# Altium project FIT_PM12.PrjPcb (part 3 of 13)

## Sheet PM12_LDO.SchDoc: FIT_PM12 board
size 420 x 297 mm; CheckedBy: G.Kasprowicz; Author: INR Moscow; CompanyName: WUT ISE; DrawnBy: M.Podgórski; Organization: WUT ISE; Address1: PW ISE; Address2: Nowowiejska 15/19 00-665 Warsaw; Address3: gkasprow@gmail.com; DocumentNumber: 12; Revision: 2; SheetNumber: 14; SheetTotal: 34; ModifiedBy: -; CheckedDate: -; Title2: LDOs; DivGrp: WUT ISE; Designer: INR RAS; ModifiedDate: -; ProjectName: Sensor Box
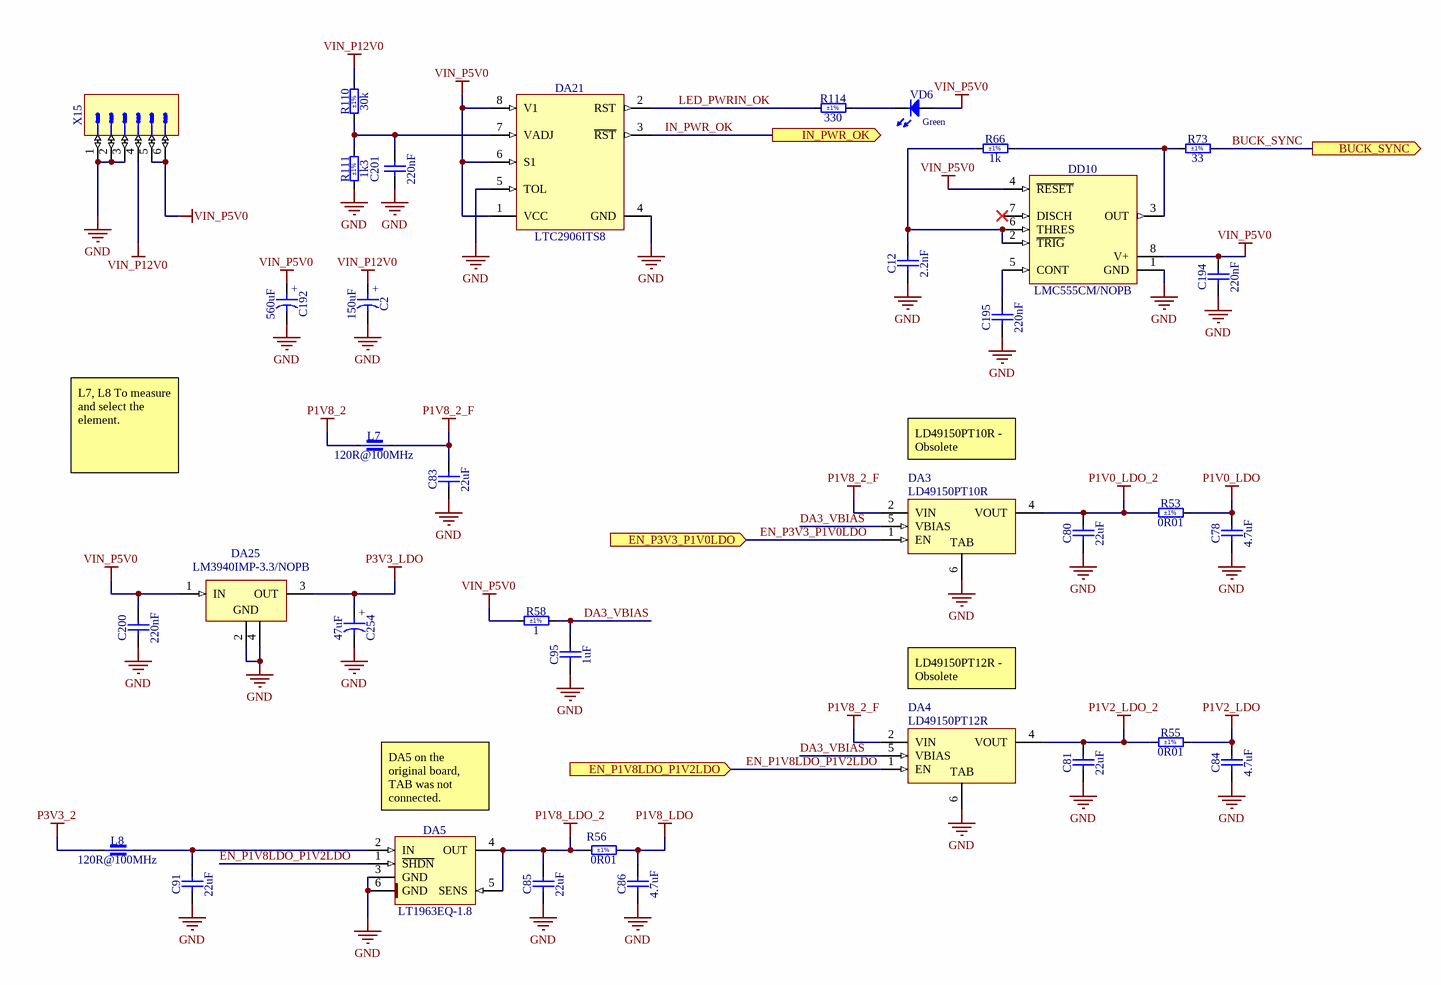
[diagram p6: PM12_LDO.SchDoc]

### Parts
C2  150uF  [CAPAE830X1020N]
C12  2.2nF  [CAPC2013X100N]
C78  4.7uF  [CAPC2012X145N]
C80  22uF  [CAPC3216X180N]
C81  22uF  [CAPC3216X180N]
C83  22uF  [CAPC3216X180N]
C84  4.7uF  [CAPC2012X145N]
C85  22uF  [CAPC3216X180N]
C86  4.7uF  [CAPC2012X145N]
C91  22uF  [CAPC3216X180N]
C95  1uF  [CAPC2012X140N]
C192  560uF  [CAPAE830X1020N]
C194  220nF  [CAPC2012X135N]
C195  220nF  [CAPC2012X135N]
C200  220nF  [CAPC2012X135N]
C201  220nF  [CAPC2012X135N]
C254  47uF  [CAPAE530X610N]
DA3  LD49150PT10R  [PPAK_N]
DA4  LD49150PT12R  [PPAK_M]
DA5  LT1963EQ-1.8  [TO170P1394X457-6N-R900X1060]
DA21  LTC2906ITS8  [SOT65P280X100-8N]
DA25  LM3940IMP-3.3/NOPB  [SOT230P700X180-4N]
DD10  LMC555CM/NOPB  [SOIC127P600X175-8N]
L7  120R@100MHz  [IND_MURATA_BLM31KN]
L8  120R@100MHz  [IND_MURATA_BLM31KN]
R53  0R01  Tolerance: ±1%  [RESC3216X80N]
R55  0R01  Tolerance: ±1%  [RESC3216X80N]
R56  0R01  Tolerance: ±1%  [RESC3216X80N]
R58  1  Tolerance: ±1%  [RESC2012X60N]
R66  1k  Tolerance: ±1%  [RESC2012X60N]
R73  33  Tolerance: ±1%  [RESC2012X60N]
R110  30k  Tolerance: ±1%  [RESC2012X60N]
R111  1k3  Tolerance: ±1%  [RESC2012X60N]
R114  330  Tolerance: ±1%  [RESC2012X60N]
VD6  Green  [LED_KINGBRIGHT_KP-2012LSGC]
X15  Mini-Fit BMI  [MOLEX_15-24-9067]  (value not drawn)

### Ports
BUCK_SYNC (out), EN_P1V8LDO_P1V2LDO (in), EN_P3V3_P1V0LDO (in), IN_PWR_OK (out)

### Nets
GND: C2.2 C12.1 C78.1 C80.1 C81.1 C83.1 C84.1 C85.1 C86.1 C91.1 C95.1 C192.2 C194.1 C195.1 C200.1 C201.1 C254.2 DA3.6(TAB) DA4.6(TAB) DA5.3(GND) DA5.6(GND) DA21.4(GND) DA21.5(TOL) DA25.2(GND) DA25.4(GND) DD10.1(GND) R111.1 X15.1 X15.2 X15.3
P1V0_LDO: C78.2 R53.2
P1V0_LDO_2: C80.2 DA3.4(VOUT) R53.1
P1V2_LDO: C84.2 R55.2
P1V2_LDO_2: C81.2 DA4.4(VOUT) R55.1
P1V8_2: L7.1
P1V8_2_F: C83.2 DA3.2(VIN) DA4.2(VIN) L7.2
P1V8_LDO: C86.2 R56.2
P1V8_LDO_2: C85.2 DA5.4(OUT) DA5.5(SENS) R56.1
P3V3_2: L8.1
P3V3_LDO: C254.1 DA25.3(OUT)
VIN_P5V0: C192.1 C194.2 C200.2 DA21.1(VCC) DA21.6(S1) DA21.8(V1) DA25.1(IN) DD10.4(~{RESET}) DD10.8(V+) R58.1 VD6.2(A) X15.5 X15.6  [project net P3V3]
VIN_P12V0: C2.1 R110.2 X15.4
BUCK_SYNC: R73.2 ; port BUCK_SYNC
DA3_VBIAS: C95.2 DA3.5(VBIAS) DA4.5(VBIAS) R58.2
EN_P1V8LDO_P1V2LDO: DA4.1(EN) DA5.1(~{SHDN}) ; port EN_P1V8LDO_P1V2LDO
EN_P3V3_P1V0LDO: DA3.1(EN) ; port EN_P3V3_P1V0LDO
IN_PWR_OK: DA21.3(~{RST}) ; port IN_PWR_OK
LED_PWRIN_OK: DA21.2(RST) R114.1
NetC12_2: C12.2 DD10.2(~{TRIG}) DD10.6(THRES) R66.1
NetC91_2: C91.2 DA5.2(IN) L8.2
NetC195_2: C195.2 DD10.5(CONT)
NetC201_2: C201.2 DA21.7(VADJ) R110.1 R111.2
NetDD10_3: DD10.3(OUT) R66.2 R73.1
NetR114_2: R114.2 VD6.1(C)

Not connected (* = marked no-connect by the designer): DD10 7(DISCH)*

### Notes on the sheet
- L7, L8 To measure and select the element.
- LD49150PT10R - Obsolete
- LD49150PT12R - Obsolete
- (near DA5) DA5 on the original board, TAB was not connected.
- Project/Equipment
- Document
- Designer
- Drawn by
- Check.by
- Copyright WUT ISE 2024.
  This documentation describes Open Hardware and is licensed under the CERN OHL v.2. You may redistribute and modify this documentation under the terms of the CERN OHL v.2. (http://ohwr.org/CERNOHL). This documentation is distributed WITHOUT ANY EXPRESS OR IMPLIED WARRANTY, INCLUDING OF MERCHANTABILITY, SATISFACTORY QUALITY AND FITNESS FOR A PARTICULAR PURPOSE. Please see the CERN OHL v.2 for applicable conditions.
- Contact
- File
- Last Mod.
- Print Date
- Sheet
- Size
- A3
- of
- Rev
- (in symbol CAE530-610_47UF_16V_20%) +
- (in symbol CAE830-1020_150UF_25V_20%) +
- (in symbol CAE830-1020_560UF_10V_20%) +

### Library data of the parts
C2 = CAE830-1020_150UF_25V_20%: Polarised capacitor; Part Description: Aluminum Electrolytic SMT Capacitor; Manufacturer: PANASONIC; Manufacturer Part Number: EEEFP1E151AP; Voltage: 25V; Tolerance: ±20%; Part Number: CAE830-1020_150UF_25V_20%; Component Kind: Standard; Component Type: Standard; Pin Count: 2; Value: 150uF; Status: Not Recommended; Case: F; Mounted: Yes; Socket: No; SMD: Yes; Sense: No; ComponentHeight: 10.2mm; HelpURL: \\cern.ch\dfs\Applications\Altium\Datasheets\CAE_PANASONIC_FP.pdf; Author: CERN DEM HF; CreateDate: 24.05.2024; LatestRevisionDate: 24.05.2024
C12 = CC0805_2.2NF_50V_5%_C0G: Non-polarised capacitor; Part Description: SMD Multilayer Chip Ceramic Capacitor; Manufacturer: GENERIC; Manufacturer1 Part Number: C0805C222J5GACTU; Voltage: 50V; TC: C0G/NP0; Tolerance: ±5%; Part Number: CC0805_2.2NF_50V_5%_C0G; Component Kind: Standard; Component Type: Standard; Pin Count: 2; Value: 2.2nF; Status: None; Manufacturer Part Number: CC0805_2.2NF_50V_5%_C0G; Case: 0805; Mounted: Yes; Socket: No; SMD: Yes; Sense: No; Manufacturer1 Example: KEMET; Manufacturer1 ComponentHeight: 0.88mm; HelpURL: \\cern.ch\dfs\Applications\Altium\Datasheets\CC0805_C0G_KEMET_(Commercial Grade).pdf; Author: CERN DEM MR; CreateDate: 26.01.2016; LatestRevisionDate: 26.01.2016
C78 C84 C86 = CC0805_4.7UF_50V_10%_X7R: Non-polarised capacitor; Part Description: SMD Multilayer Chip Ceramic Capacitor; Manufacturer: GENERIC; Manufacturer1 Part Number: C2012X7R1H475K125; Voltage: 50V; TC: X7R; Tolerance: ±10%; Part Number: CC0805_4.7UF_50V_10%_X7R; Component Kind: Standard; Component Type: Standard; Pin Count: 2; Value: 4.7uF; Status: Preferred; Manufacturer Part Number: CC0805_4.7UF_50V_10%_X7R; Case: 0805; Mounted: Yes; Socket: No; SMD: Yes; Sense: No; Manufacturer1 Example: TDK; Manufacturer1 ComponentHeight: 1.45mm; HelpURL: \\cern.ch\dfs\Applications\Altium\Datasheets\CC0805_X7R_TDK_C.pdf; Author: CERN DEM JMW; CreateDate: 30.07.2021; LatestRevisionDate: 30.07.2021
C80 C81 C83 C85 C91 = CC1206_22UF_25V_20%_X5R: Non-polarised capacitor; Part Description: SMD Multilayer Chip Ceramic Capacitor; Manufacturer: GENERIC; Manufacturer1 Part Number: C3216X5R1E226M160; Voltage: 25V; TC: X5R; Tolerance: ±20%; Part Number: CC1206_22UF_25V_20%_X5R; Component Kind: Standard; Component Type: Standard; Pin Count: 2; Value: 22uF; Status: None; Manufacturer Part Number: CC1206_22UF_25V_20%_X5R; Case: 1206; Mounted: Yes; Socket: No; SMD: Yes; Sense: No; Manufacturer1 Example: TDK; Manufacturer1 ComponentHeight: 1.8mm; HelpURL: \\cern.ch\dfs\Applications\Altium\Datasheets\CC1206_X5R_TDK_C.pdf; Author: CERN DEM WB; CreateDate: 25.07.2018; LatestRevisionDate: 25.07.2018
C95 = CC0805_1UF_25V_10%_X7R: Non-polarised capacitor; Part Description: SMD Multilayer Chip Ceramic Capacitor; Manufacturer: GENERIC; Manufacturer1 Part Number: C0805C105K3RAC; Voltage: 25V; TC: X7R; Tolerance: ±10%; Part Number: CC0805_1UF_25V_10%_X7R; Component Kind: Standard; Component Type: Standard; Pin Count: 2; Value: 1uF; Status: Preferred; Manufacturer Part Number: CC0805_1UF_25V_10%_X7R; Case: 0805; Mounted: Yes; Socket: No; SMD: Yes; Sense: No; Manufacturer1 Example: KEMET; Manufacturer1 ComponentHeight: 1.4mm; HelpURL: \\cern.ch\dfs\Applications\Altium\Datasheets\CC0805_X7R_KEMET.pdf; Author: CERN DEM JLC; CreateDate: 23.03.2009; LatestRevisionDate: 23.03.2009
C192 = CAE830-1020_560UF_10V_20%: Polarised capacitor; Part Description: Aluminum Electrolytic SMT Capacitor; Manufacturer: PANASONIC; Manufacturer Part Number: EEEFH1A561L; Voltage: 10V; Tolerance: ±20%; Part Number: CAE830-1020_560UF_10V_20%; Component Kind: Standard; Component Type: Standard; Pin Count: 2; Value: 560uF; Status: Not Recommended; Case: F; Mounted: Yes; Socket: No; SMD: Yes; Sense: No; ComponentHeight: 10.2mm; HelpURL: \\cern.ch\dfs\Applications\Altium\Datasheets\CAE_PANASONIC_FH.pdf; Author: CERN DEM HF; CreateDate: 24.05.2024; LatestRevisionDate: 24.05.2024
C194 C195 C200 C201 = CC0805_220NF_50V_10%_X7R: Non-polarised capacitor; Part Description: SMD Multilayer Chip Ceramic Capacitor; Manufacturer: GENERIC; Manufacturer1 Part Number: GRM21BR71H224KA01L; Voltage: 50V; TC: X7R; Tolerance: ±10%; Part Number: CC0805_220NF_50V_10%_X7R; Component Kind: Standard; Component Type: Standard; Pin Count: 2; Value: 220nF; Status: Preferred; Manufacturer Part Number: CC0805_220NF_50V_10%_X7R; Case: 0805; Mounted: Yes; Socket: No; SMD: Yes; Sense: No; Manufacturer1 Example: MURATA; Manufacturer1 ComponentHeight: 1.35mm; HelpURL: \\cern.ch\dfs\Applications\Altium\Datasheets\CC0805_X7R_MURATA.pdf; Author: CERN DEM JLC; CreateDate: 03.12.2007; LatestRevisionDate: 03.12.2007
C254 = CAE530-610_47UF_16V_20%: Polarised capacitor; Part Description: Conductive Polymer Hybrid Aluminum Electrolytic Capacitor; Manufacturer: CHEMI-CON; Manufacturer Part Number: HHXD160ARA470ME61G; Voltage: 16V; Tolerance: ±20%; Part Number: CAE530-610_47UF_16V_20%; Component Kind: Standard; Component Type: Standard; Pin Count: 2; Value: 47uF; Status: Not Recommended; Case: C; Mounted: Yes; Socket: No; SMD: Yes; Sense: No; ComponentHeight: 6.1mm; HelpURL: \\cern.ch\dfs\Applications\Altium\Datasheets\CAE_CHIMI-CON_HXD.pdf; Author: CERN DEM HF; CreateDate: 15.04.2024; LatestRevisionDate: 15.04.2024
DA3 = CMP-0244-00092-1: 1.5 Very Low Drop Voltage Regulator, 1.0V, 5-Pin PPAK, Tape and Reel; ComponentLink1URL: http://www.st.com; ComponentLink2Description: Datasheet; PackageVersion: 1/06/2004; DatasheetVersion: 1/06/2010; PackageDescription: 5-Pin Transistor Outline Package 1.27 mm Pitch, 9.7 mm Lead Span; ComponentLink1Description: Manufacturer URL; ComponentLink2URL: http://www.st.com/internet/com/TECHNICAL_RESOURCES/TECHNICAL_LITERATURE/DATASHEET/CD00157522.pdf; PackageReference: PPAK
DA4 = CMP-0244-00093-1: 1.5 Very Low Drop Voltage Regulator, 1.2V, 5-Pin PPAK, Tape and Reel; ComponentLink2URL: http://www.st.com/internet/com/TECHNICAL_RESOURCES/TECHNICAL_LITERATURE/DATASHEET/CD00157522.pdf; DatasheetVersion: 1/06/2010; ComponentLink1Description: Manufacturer URL; ComponentLink2Description: Datasheet; ComponentLink1URL: http://www.st.com; PackageDescription: 5-Pin Transistor Outline Package 1.27 mm Pitch, 9.7 mm Lead Span; PackageReference: PPAK; PackageVersion: 1/06/2004
DA5 = LT1963EQ-1.8: 1.5A, Fast Transient Response LDO Regulators; Part Description: 1.5A, 1.8V, Fast Transient Response, LDO Regulator; Manufacturer: ANALOG DEVICES; PressFit: No; Bonding: No; Part Number: LT1963EQ-1.8; Component Kind: Standard; Component Type: Standard; Device: LT1963EQ-1.8; PackageDescription: D2PAK TO-263, TO, 1.70mm Pitch; 5 Pin, 13.945mm L X 8.89mm W X 4.572mm H body, IPC Medium Density; Manufacturer Part Number: LT1963EQ-1.8; Pin Count: 6; Case: TO-263-5; Mounted: Yes; Socket: No; SMD: Yes; Sense: No; ComponentHeight: 4.57mm; HelpURL: \\cern.ch\dfs\Applications\Altium\Datasheets\LT1963.pdf; Author: CERN DEM HF; CreateDate: 05.06.2024; LatestRevisionDate: 05.06.2024
DA21 = LTC2906ITS8: Precision Dual Supply Monitors with One Pin-Selectable Threshold and One Adjustable Input; Manufacturer: LINEAR TECHNOLOGY; PressFit: No; Bonding: No; Part Number: LTC2906ITS8; Component Kind: Standard; Component Type: Standard; Device: LTC2906ITS8; PackageDescription: SOT, 0.65mm Pitch; 8 Pin, 1.625mm W X 2.90mm L X 1.00mm H Body, IPC Medium Density; Part Description: Precision Dual Supply Monitors with One Pin-Selectable Threshold and One Adjustable Input; Manufacturer Part Number: LTC2906ITS8; Pin Count: 8; Case: SOT23-8; Mounted: Yes; Socket: No; SMD: Yes; Sense: No; ComponentHeight: 1mm; Author: CERN DEM HF; HelpURL: \\cern.ch\dfs\Applications\Altium\Datasheets\LTC2906.pdf; CreateDate: 05.06.2024; LatestRevisionDate: 05.06.2024
DA25 = LM3940IMP-3.3/NOPB: 3-Terminal Regulator 1=IN 2=GND 3=OUT 4=GND; Part Description: 1A Low Dropout Regulator for 5V to 3.3V Conversion; Manufacturer: TEXAS INSTRUMENTS; PressFit: No; Bonding: No; Part Number: LM3940IMP-3.3/NOPB; Component Kind: Standard; Component Type: Standard; Device: LM3940IMP-3.3/NOPB; PackageDescription: SOT223, 2.30mm Pitch; 4 Pin, 3.70mm W X 6.70mm L X 1.80mm H body, IPC Medium Density; Manufacturer Part Number: LM3940IMP-3.3; Pin Count: 4; Case: SOT223; Mounted: Yes; Socket: No; SMD: Yes; Sense: No; ComponentHeight: 1.8mm; HelpURL: \\cern.ch\dfs\Applications\Altium\Datasheets\LM3940IMP-3.3-NOPB.pdf; Author: CERN DEM JLC; CreateDate: 28.03.2011; LatestRevisionDate: 01.06.2022
DD10 = LMC555CM/NOPB: CMOS Timer; Manufacturer: NATIONAL SEMICONDUCTOR; PressFit: No; Bonding: No; Part Number: LMC555CM/NOPB; Component Kind: Standard; Component Type: Standard; Device: LMC555CM/NOPB; PackageDescription: SOIC 8, Pitch 1.27mm, Body 4x5mm, IPC Medium Density; Part Description: CMOS Timer; Manufacturer Part Number: LMC555CM; Pin Count: 8; Case: SOIC8; Mounted: Yes; Socket: No; SMD: Yes; Sense: No; ComponentHeight: 1.75mm; Author: CERN DEM JLC; HelpURL: \\cern.ch\dfs\Applications\Altium\Datasheets\LMC555C-NOPB.pdf; CreateDate: 12.04.2010; LatestRevisionDate: 01.06.2022
L7 L8 = IND1206_MURATA_BLM31KN121SN1: Part Description: SMD Chip Ferrite Bead, BLM31KN_SN Series; Manufacturer: MURATA; Power: 6A; Resistance: 0.009R; Tolerance: ±25%; Part Number: IND1206_MURATA_BLM31KN121SN1; Component Kind: Standard; Component Type: Standard; Footprint: IND_MURATA_BLM31KN1; Pin Count: 2; Value: 120R@100MHz; Manufacturer Part Number: BLM31KN121SN1; Case: 1206; Mounted: Yes; Socket: No; SMD: Yes; Sense: No; ComponentHeight: 1.8mm; HelpURL: \\cern.ch\dfs\Applications\Altium\Datasheets\IND1206_MURATA_ BLM31KN_SN.pdf; Author: CERN DEM HF; CreateDate: 05.01.2022; LatestRevisionDate: 05.01.2022
R53 R55 R56 = R1206_0R01_1%_1W_100PPM_TT_LRMAM1206: Resistor - 1%; Part Description: Low Value Metal Alloy Resistor; Manufacturer: TT Electronics; Manufacturer Part Number: LRMAM1206-R01FT5; Power: 1W; TC: ±100ppm/°C; PressFit: No; Part Number: R1206_0R01_1%_1W_100PPM_TT_LRMAM1206; Component Kind: Standard; Component Type: Standard; Pin Count: 2; Value: 0R01; Status: Not Recommended; Case: 1206; Mounted: Yes; Sense: No; Socket: No; SMD: Yes; ComponentHeight: 0.8mm; HelpURL: \\cern.ch\dfs\Applications\Altium\Datasheets\R1206_TT ELECTRONICS_LRMA.pdf; Author: CERN DEM BC; CreateDate: 29.07.2015; LatestRevisionDate: 29.07.2015
R58 = R0805_1R_1%_0.125W_100PPM: Resistor - 1%; Part Description: Thick Film Chip Resistor; Manufacturer: GENERIC; Manufacturer1 Part Number: CRCW08051R00FKEA; Power: 0.125W; TC: ±100ppm/°C; PressFit: No; Part Number: R0805_1R_1%_0.125W_100PPM; Component Kind: Standard; Component Type: Standard; Pin Count: 2; Value: 1; Status: None; Manufacturer Part Number: R0805_1R_1%_0.125W_100PPM; Case: 0805; Mounted: Yes; Sense: No; Socket: No; SMD: Yes; Manufacturer1 Example: VISHAY; Manufacturer1 ComponentHeight: 0.6mm; HelpURL: \\cern.ch\dfs\Applications\Altium\Datasheets\R0805_VISHAY_CRCW e3.pdf; Author: CERN DEM HF; CreateDate: 07.06.2024; LatestRevisionDate: 07.06.2024
R66 = R0805_1K_1%_0.125W_100PPM: Resistor - 1%; Part Description: General Purpose Thick Film Chip Resistor; Manufacturer: GENERIC; Manufacturer1 Part Number: NRC10F1001TRF; Power: 0.125W; TC: ±100ppm/°C; PressFit: No; Part Number: R0805_1K_1%_0.125W_100PPM; Component Kind: Standard; Component Type: Standard; Pin Count: 2; Value: 1k; Status: Preferred; Manufacturer Part Number: R0805_1K_1%_0.125W_100PPM; Case: 0805; Mounted: Yes; Sense: No; Socket: No; SMD: Yes; Manufacturer1 Example: NIC COMPONENT; Manufacturer1 ComponentHeight: 0.6mm; HelpURL: \\cern.ch\dfs\Applications\Altium\Datasheets\R0805_NIC_NRC.pdf; Author: CERN DEM JLC; CreateDate: 03.12.2007; LatestRevisionDate: 13.03.2008
R73 = R0805_33R_1%_0.125W_100PPM: Resistor - 1%; Part Description: General Purpose Thick Film Chip Resistor; Manufacturer: GENERIC; Manufacturer1 Part Number: NRC10F33R0TRF; Power: 0.125W; TC: ±100ppm/°C; PressFit: No; Part Number: R0805_33R_1%_0.125W_100PPM; Component Kind: Standard; Component Type: Standard; Pin Count: 2; Value: 33; Status: Preferred; Manufacturer Part Number: R0805_33R_1%_0.125W_100PPM; Case: 0805; Mounted: Yes; Sense: No; Socket: No; SMD: Yes; Manufacturer1 Example: NIC COMPONENT; Manufacturer1 ComponentHeight: 0.6mm; HelpURL: \\cern.ch\dfs\Applications\Altium\Datasheets\R0805_NIC_NRC.pdf; Author: CERN DEM JLC; CreateDate: 03.12.2007; LatestRevisionDate: 13.03.2008
R110 = R0805_30K_1%_0.125W_100PPM: Resistor - 1%; Part Description: General Purpose Thick Film Chip Resistor; Manufacturer: GENERIC; Manufacturer1 Part Number: NRC10F3002TRF; Power: 0.125W; TC: ±100ppm/°C; PressFit: No; Part Number: R0805_30K_1%_0.125W_100PPM; Component Kind: Standard; Component Type: Standard; Pin Count: 2; Value: 30k; Status: Preferred; Manufacturer Part Number: R0805_30K_1%_0.125W_100PPM; Case: 0805; Mounted: Yes; Sense: No; Socket: No; SMD: Yes; Manufacturer1 Example: NIC COMPONENT; Manufacturer1 ComponentHeight: 0.6mm; HelpURL: \\cern.ch\dfs\Applications\Altium\Datasheets\R0805_NIC_NRC.pdf; Author: CERN DEM JLC; CreateDate: 03.12.2007; LatestRevisionDate: 13.03.2008
R111 = R0805_1K3_1%_0.125W_100PPM: Resistor - 1%; Part Description: General Purpose Thick Film Chip Resistor; Manufacturer: GENERIC; Manufacturer1 Part Number: NRC10F1301TRF; Power: 0.125W; TC: ±100ppm/°C; PressFit: No; Part Number: R0805_1K3_1%_0.125W_100PPM; Component Kind: Standard; Component Type: Standard; Pin Count: 2; Value: 1k3; Status: Preferred; Manufacturer Part Number: R0805_1K3_1%_0.125W_100PPM; Case: 0805; Mounted: Yes; Sense: No; Socket: No; SMD: Yes; Manufacturer1 Example: NIC COMPONENT; Manufacturer1 ComponentHeight: 0.6mm; HelpURL: \\cern.ch\dfs\Applications\Altium\Datasheets\R0805_NIC_NRC.pdf; Author: CERN DEM JLC; CreateDate: 03.12.2007; LatestRevisionDate: 13.03.2008
R114 = R0805_330R_1%_0.125W_100PPM: Resistor - 1%; Part Description: General Purpose Thick Film Chip Resistor; Manufacturer: GENERIC; Manufacturer1 Part Number: NRC10F3300TRF; Power: 0.125W; TC: ±100ppm/°C; PressFit: No; Part Number: R0805_330R_1%_0.125W_100PPM; Component Kind: Standard; Component Type: Standard; Pin Count: 2; Value: 330; Status: Preferred; Manufacturer Part Number: R0805_330R_1%_0.125W_100PPM; Case: 0805; Mounted: Yes; Sense: No; Socket: No; SMD: Yes; Manufacturer1 Example: NIC COMPONENT; Manufacturer1 ComponentHeight: 0.6mm; HelpURL: \\cern.ch\dfs\Applications\Altium\Datasheets\R0805_NIC_NRC.pdf; Author: CERN DEM JLC; CreateDate: 03.12.2007; LatestRevisionDate: 13.03.2008
VD6 = LED_KINGBRIGHT_KP-2012LSGC: LED Green 1C 2A; Part Description: 2.0x1.2mm Surface Mount Green LED; PressFit: No; Bonding: No; Part Number: LED_KINGBRIGHT_KP-2012LSGC; Component Kind: Standard; Component Type: Standard; Color: Green; PackageDescription: 2.0x1.2mm Surface Mount Green LED; Manufacturer: KINGBRIGHT; Manufacturer Part Number: KP-2012LSGC; Pin Count: 2; Case: 0805; Mounted: Yes; Socket: No; SMD: Yes; Sense: No; ComponentHeight: 1.1mm; HelpURL: \\cern.ch\dfs\Applications\Altium\Datasheets\LED_KINGBRIGHT_KP-2012LSGC.pdf; Author: CERN DEM BC; CreateDate: 09.11.2020; LatestRevisionDate: 09.11.2020
X15 = MOLEX_15-24-9067: Connector 6 Male; Part Description: Mini-Fit BMI Header, Dual Row, Right-Angle, with Snap-in Plastic Peg PCB Lock, 6 Circuits, Gold (Au) Plating; Manufacturer: MOLEX; PressFit: No; Part Number: MOLEX_15-24-9067; Component Kind: Standard; Component Type: Standard; Pin Count: 6; Family: Mini-Fit BMI; Mounted: Yes; Socket: No; SMD: No; Sense: No; Status: None; Manufacturer Part Number: 15-24-9067; ComponentHeight: 15mm; HelpURL: \\cern.ch\dfs\Applications\Altium\Datasheets\MOLEX_15-24-9067.pdf; Author: CERN DEM HF; CreateDate: 06.06.2024; LatestRevisionDate: 06.06.2024

## Sheet PM12_Supply_LED.SchDoc: FIT_PM12 board
size 420 x 297 mm; CheckedBy: G.Kasprowicz; Author: INR Moscow; CompanyName: WUT ISE; DrawnBy: M.Podgórski; Organization: WUT ISE; Address1: PW ISE; Address2: Nowowiejska 15/19 00-665 Warsaw; Address3: gkasprow@gmail.com; DocumentNumber: 14; Revision: 2; SheetNumber: 15; SheetTotal: 34; ModifiedBy: -; CheckedDate: -; Title2: PSU logics LEDs; DivGrp: WUT ISE; Designer: INR RAS; ModifiedDate: -; ProjectName: Sensor Box
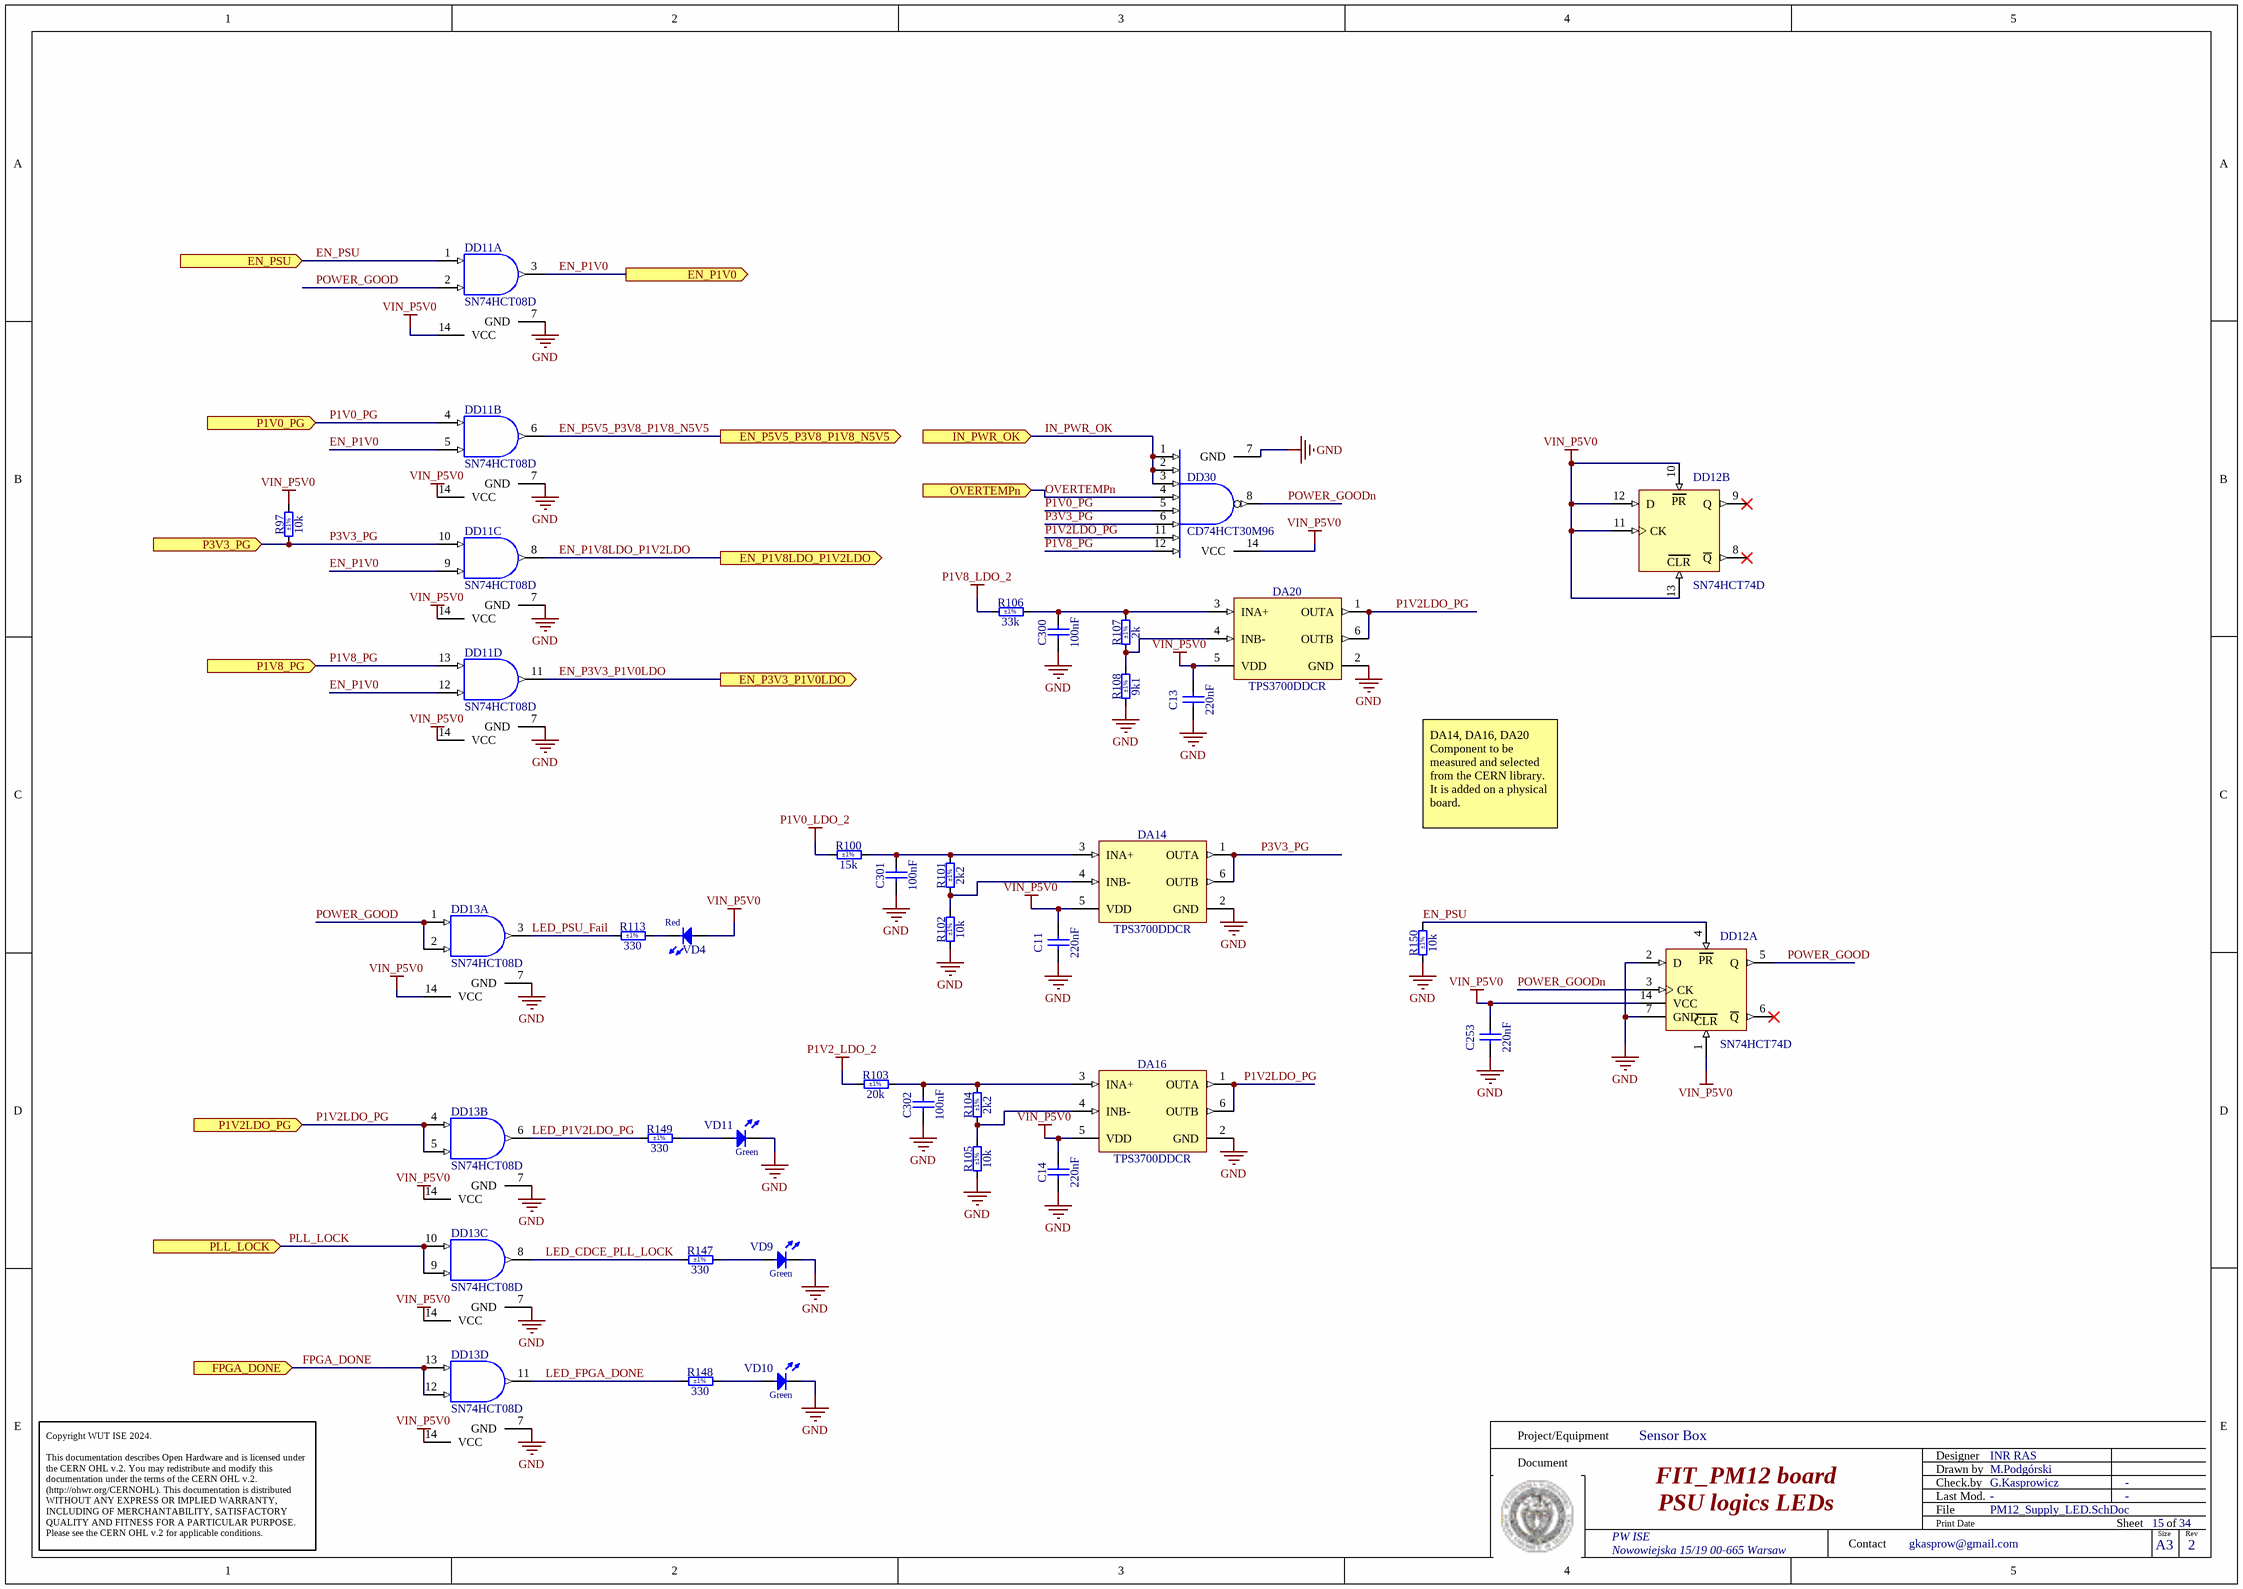
[diagram p7: PM12_Supply_LED.SchDoc]

### Parts
C11  220nF  [CAPC2012X135N]
C13  220nF  [CAPC2012X135N]
C14  220nF  [CAPC2012X135N]
C253  220nF  [CAPC2012X135N]
C300  100nF  [CAPC1005X55N]
C301  100nF  [CAPC1005X55N]
C302  100nF  [CAPC1005X55N]
DA14  TPS3700DDCR  [SOT95P280X110-6N]
DA16  TPS3700DDCR  [SOT95P280X110-6N]
DA20  TPS3700DDCR  [SOT95P280X110-6N]
DD11  SN74HCT08D  [SOIC127P600X175-14N]  (parts A,B,C,D of 4)
DD12  SN74HCT74D  [SOIC127P600X175-14N]  (parts A,B of 2)
DD13  SN74HCT08D  [SOIC127P600X175-14N]  (parts A,B,C,D of 4)
DD30  CD74HCT30M96  [SOIC127P600X175-14N]
R97  10k  Tolerance: ±1%  [RESC2012X60N]
R100  15k  Tolerance: ±1%  [RESC2012X60N]
R101  2k2  Tolerance: ±1%  [RESC2012X60N]
R102  10k  Tolerance: ±1%  [RESC2012X60N]
R103  20k  Tolerance: ±1%  [RESC2012X60N]
R104  2k2  Tolerance: ±1%  [RESC2012X60N]
R105  10k  Tolerance: ±1%  [RESC2012X60N]
R106  33k  Tolerance: ±1%  [RESC2012X60N]
R107  2k  Tolerance: ±1%  [RESC2012X60N]
R108  9k1  Tolerance: ±1%  [RESC2012X60N]
R113  330  Tolerance: ±1%  [RESC2012X60N]
R147  330  Tolerance: ±1%  [RESC2012X60N]
R148  330  Tolerance: ±1%  [RESC2012X60N]
R149  330  Tolerance: ±1%  [RESC2012X60N]
R150  10k  Tolerance: ±1%  [RESC2012X60N]
VD4  Red  [LED_KINGBRIGHT_KPT-2012SURCK]
VD9  Green  [LED_KINGBRIGHT_KP-2012LSGC]
VD10  Green  [LED_KINGBRIGHT_KP-2012LSGC]
VD11  Green  [LED_KINGBRIGHT_KP-2012LSGC]

### Ports
EN_P1V0 (out), EN_P1V8LDO_P1V2LDO (out), EN_P3V3_P1V0LDO (out), EN_P5V5_P3V8_P1V8_N5V5 (out), EN_PSU (in), FPGA_DONE (in), IN_PWR_OK (in), OVERTEMPn (in), P1V0_PG (in), P1V2LDO_PG (in), P1V8_PG (in), P3V3_PG (in), PLL_LOCK (in)

### Nets
GND: C11.1 C13.1 C14.1 C253.1 C300.1 C301.1 C302.1 DA14.2(GND) DA16.2(GND) DA20.2(GND) DD11.7(GND) DD12.2(D) DD12.7(GND) DD13.7(GND) DD30.7(GND) R102.1 R105.1 R108.1 R150.1 VD9.1(C) VD10.1(C) VD11.1(C)
P1V0_LDO_2: R100.1
P1V2_LDO_2: R103.1
P1V8_LDO_2: R106.1
VCC: C11.2 C13.2 C14.2 C253.2 DA14.5(VDD) DA16.5(VDD) DA20.5(VDD) DD11.14(VCC) DD12.1(~{CLR}) DD12.10(~{PR}) DD12.11(CK) DD12.12(D) DD12.13(~{CLR}) DD12.14(VCC) DD13.14(VCC) DD30.14(VCC) R97.2 VD4.2(A)  [also labelled VIN_P5V0]  [project net P3V3]
EN_P1V0: DD11.3(Y) DD11.5(B) DD11.9(B) DD11.12(B) ; port EN_P1V0
EN_P1V8LDO_P1V2LDO: DD11.8(Y) ; port EN_P1V8LDO_P1V2LDO
EN_P3V3_P1V0LDO: DD11.11(Y) ; port EN_P3V3_P1V0LDO
EN_P5V5_P3V8_P1V8_N5V5: DD11.6(Y) ; port EN_P5V5_P3V8_P1V8_N5V5
EN_PSU: DD11.1(A) DD12.4(~{PR}) R150.2 ; port EN_PSU
FPGA_DONE: DD13.12(B) DD13.13(A) ; port FPGA_DONE
IN_PWR_OK: DD30.1(A) DD30.2(B) DD30.3(C) ; port IN_PWR_OK
LED_CDCE_PLL_LOCK: DD13.8(Y) R147.1
LED_FPGA_DONE: DD13.11(Y) R148.1
LED_P1V2LDO_PG: DD13.6(Y) R149.1
LED_PSU_Fail: DD13.3(Y) R113.1
OVERTEMPn: DD30.4(D) ; port OVERTEMPn
P1V0_PG: DD11.4(A) DD30.5(E) ; port P1V0_PG
P1V2LDO_PG: DA16.1(OUTA) DA16.6(OUTB) DA20.1(OUTA) DA20.6(OUTB) DD13.4(A) DD13.5(B) DD30.11(G) ; port P1V2LDO_PG
P1V8_PG: DD11.13(A) DD30.12(H) ; port P1V8_PG
P3V3_PG: DA14.1(OUTA) DA14.6(OUTB) DD11.10(A) DD30.6(F) R97.1 ; port P3V3_PG
PLL_LOCK: DD13.9(B) DD13.10(A) ; port PLL_LOCK
POWER_GOOD: DD11.2(B) DD12.5(Q) DD13.1(A) DD13.2(B)
POWER_GOODn: DD12.3(CK) DD30.8(Y)
NetC300_2: C300.2 DA20.3(INA+) R106.2 R107.2
NetC301_2: C301.2 DA14.3(INA+) R100.2 R101.2
NetC302_2: C302.2 DA16.3(INA+) R103.2 R104.2
NetDA14_4: DA14.4(INB-) R101.1 R102.2
NetDA16_4: DA16.4(INB-) R104.1 R105.2
NetDA20_4: DA20.4(INB-) R107.1 R108.2
NetR113_2: R113.2 VD4.1(C)
NetR147_2: R147.2 VD9.2(A)
NetR148_2: R148.2 VD10.2(A)
NetR149_2: R149.2 VD11.2(A)

Not connected (* = marked no-connect by the designer): DD12 6(~{Q})* 8(~{Q})* 9(Q)*

### Notes on the sheet
- DA14, DA16, DA20 Component to be measured and selected from the CERN library. It is added on a physical board.
- Project/Equipment
- Document
- Designer
- Drawn by
- Check.by
- Copyright WUT ISE 2024.
  This documentation describes Open Hardware and is licensed under the CERN OHL v.2. You may redistribute and modify this documentation under the terms of the CERN OHL v.2. (http://ohwr.org/CERNOHL). This documentation is distributed WITHOUT ANY EXPRESS OR IMPLIED WARRANTY, INCLUDING OF MERCHANTABILITY, SATISFACTORY QUALITY AND FITNESS FOR A PARTICULAR PURPOSE. Please see the CERN OHL v.2 for applicable conditions.
- Contact
- File
- Last Mod.
- Print Date
- Sheet
- Size
- A3
- of
- Rev
- (in symbol SN74HCT74D, part A) PR; CLR
- (in symbol SN74HCT74D, part B) PR; CLR

### Library data of the parts
C11 C13 C14 C253 = CC0805_220NF_50V_10%_X7R: as C194 on sheet PM12_LDO; Part Number: CC0805_220NF_50V_10%_X7R; Component Kind: Standard; Component Type: Standard; Pin Count: 2; Value: 220nF; Status: Preferred; Manufacturer Part Number: CC0805_220NF_50V_10%_X7R; Case: 0805; Mounted: Yes; Socket: No; SMD: Yes; Sense: No; Manufacturer1 Example: MURATA; Manufacturer1 ComponentHeight: 1.35mm; HelpURL: \\cern.ch\dfs\Applications\Altium\Datasheets\CC0805_X7R_MURATA.pdf; Author: CERN DEM JLC; CreateDate: 03.12.2007; LatestRevisionDate: 03.12.2007
C300-C302 = CC0402_100NF_50V_10%_X7R: Non-polarised capacitor; Part Description: SMD Multilayer Chip Ceramic Capacitor; Manufacturer: GENERIC; Manufacturer1 Part Number: GRM155R71H104KE14D; Voltage: 50V; TC: X7R; Tolerance: ±10%; Part Number: CC0402_100NF_50V_10%_X7R; Component Kind: Standard; Component Type: Standard; Pin Count: 2; Value: 100nF; Status: None; Manufacturer Part Number: CC0402_100NF_50V_10%_X7R; Case: 0402; Mounted: Yes; Socket: No; SMD: Yes; Sense: No; Manufacturer1 Example: MURATA; Manufacturer1 ComponentHeight: 0.55mm; HelpURL: \\cern.ch\dfs\Applications\Altium\Datasheets\CC0402_MURATA_GRM155R71H104KE14D.pdf; Author: CERN DEM MR; CreateDate: 30.06.2017; LatestRevisionDate: 30.06.2017
DA14 DA16 DA20 = TPS3700DDCR: Window Comparator for Over- and Undervoltage Detection; Manufacturer: TEXAS INSTRUMENTS; PressFit: No; Bonding: No; Part Number: TPS3700DDCR; Component Kind: Standard; Component Type: Standard; Device: TPS3700DDCR; PackageDescription: SOT, 0.95mm Pitch; 6 Pin, 1.60mm W X 2.90mm L X 1.10mm H body, IPC Medium Density; Part Description: Window Comparator for Over- and Undervoltage Detection; Manufacturer Part Number: TPS3700DDCR; Pin Count: 6; Case: SOT23-6; Mounted: Yes; Socket: No; SMD: Yes; Sense: No; ComponentHeight: 1.1mm; Author: CERN DEM JMW; HelpURL: \\cern.ch\dfs\Applications\Altium\Datasheets\TPS3700DDCR.pdf; CreateDate: 12.02.2014; LatestRevisionDate: 12.02.2014
DD11 DD13 = SN74HCT08D: Quad 2-Input AND Gate; Part Description: Quadruple 2-Input Positive-AND Gate; Manufacturer: TEXAS INSTRUMENTS; PressFit: No; Bonding: No; Part Number: SN74HCT08D; Component Kind: Standard; Component Type: Standard; Device: SN74HCT08D; PackageDescription: SOIC, 1.27mm Pitch; 14 Pin, 4.00mm W X 8.75mm L X 1.75mm H body, IPC Medium Density; Manufacturer Part Number: SN74HCT08D; Pin Count: 14; Case: SOIC14; Mounted: Yes; Socket: No; SMD: Yes; Sense: No; ComponentHeight: 1.75mm; Author: CERN DEM HF; HelpURL: \\cern.ch\dfs\Applications\Altium\Datasheets\SN74HCT08.pdf; CreateDate: 10.06.2024; LatestRevisionDate: 10.06.2024
DD12 = SN74HCT74D: Dual D-Type Flip Flop with Preset and Clear; Part Description: Dual Positive-Edge-Triggered D-Type Flip-Flop with Clear and Preset; Manufacturer: TEXAS INSTRUMENTS; PressFit: No; Bonding: No; Part Number: SN74HCT74D; Component Kind: Standard; Component Type: Standard; Device: SN74HCT74D; PackageDescription: SOIC 14, Pitch 1.27mm - Body 4x8.75mm, IPC Medium Density; Manufacturer Part Number: SN74HCT74D; Pin Count: 14; Case: SOIC14; Mounted: Yes; Socket: No; SMD: Yes; Sense: No; ComponentHeight: 1.75mm; Author: CERN DEM JLC; HelpURL: \\cern.ch\dfs\Applications\Altium\Datasheets\SN74HCT74D.pdf; CreateDate: 11.12.2018; LatestRevisionDate: 11.12.2018
DD30 = CD74HCT30M96: 8-Input NAND Gate; Manufacturer: TEXAS INSTRUMENTS; PressFit: No; Bonding: No; Part Number: CD74HCT30M96; Component Kind: Standard; Component Type: Standard; Device: CD74HCT30M96; PackageDescription: SOIC 14, Pitch 1.27mm - Body 4x8.75mm, IPC Medium Density; Part Description: 8-Input NAND Gate; Manufacturer Part Number: CD74HCT30M96; Pin Count: 14; Case: SOIC14; Mounted: Yes; Socket: Yes; SMD: Yes; Sense: No; ComponentHeight: 1.75mm; Author: CERN DEM HF; HelpURL: \\cern.ch\dfs\Applications\Altium\Datasheets\CD74HCT30M96.pdf; CreateDate: 31.05.2024; LatestRevisionDate: 31.05.2024
R97 R102 R105 R150 = R0805_10K_1%_0.125W_100PPM: Resistor - 1%; Part Description: General Purpose Thick Film Chip Resistor; Manufacturer: GENERIC; Manufacturer1 Part Number: NRC10F1002TRF; Power: 0.125W; TC: ±100ppm/°C; PressFit: No; Part Number: R0805_10K_1%_0.125W_100PPM; Component Kind: Standard; Component Type: Standard; Pin Count: 2; Value: 10k; Status: Preferred; Manufacturer Part Number: R0805_10K_1%_0.125W_100PPM; Case: 0805; Mounted: Yes; Sense: No; Socket: No; SMD: Yes; Manufacturer1 Example: NIC COMPONENT; Manufacturer1 ComponentHeight: 0.6mm; HelpURL: \\cern.ch\dfs\Applications\Altium\Datasheets\R0805_NIC_NRC.pdf; Author: CERN DEM JLC; CreateDate: 03.12.2007; LatestRevisionDate: 13.03.2008
R100 = R0805_15K_1%_0.125W_100PPM: Resistor - 1%; Part Description: General Purpose Thick Film Chip Resistor; Manufacturer: GENERIC; Manufacturer1 Part Number: NRC10F1502TRF; Power: 0.125W; TC: ±100ppm/°C; PressFit: No; Part Number: R0805_15K_1%_0.125W_100PPM; Component Kind: Standard; Component Type: Standard; Pin Count: 2; Value: 15k; Status: Preferred; Manufacturer Part Number: R0805_15K_1%_0.125W_100PPM; Case: 0805; Mounted: Yes; Sense: No; Socket: No; SMD: Yes; Manufacturer1 Example: NIC COMPONENT; Manufacturer1 ComponentHeight: 0.6mm; HelpURL: \\cern.ch\dfs\Applications\Altium\Datasheets\R0805_NIC_NRC.pdf; Author: CERN DEM JLC; CreateDate: 13.05.2013; LatestRevisionDate: 13.05.2013
R101 R104 = R0805_2K2_1%_0.125W_100PPM: Resistor - 1%; Part Description: General Purpose Thick Film Chip Resistor; Manufacturer: GENERIC; Manufacturer1 Part Number: NRC10F2201TRF; Power: 0.125W; TC: ±100ppm/°C; PressFit: No; Part Number: R0805_2K2_1%_0.125W_100PPM; Component Kind: Standard; Component Type: Standard; Pin Count: 2; Value: 2k2; Status: Preferred; Manufacturer Part Number: R0805_2K2_1%_0.125W_100PPM; Case: 0805; Mounted: Yes; Sense: No; Socket: No; SMD: Yes; Manufacturer1 Example: NIC COMPONENT; Manufacturer1 ComponentHeight: 0.6mm; HelpURL: \\cern.ch\dfs\Applications\Altium\Datasheets\R0805_NIC_NRC.pdf; Author: CERN DEM JLC; CreateDate: 03.12.2007; LatestRevisionDate: 13.03.2008
R103 = R0805_20K_1%_0.125W_100PPM: Resistor - 1%; Part Description: General Purpose Thick Film Chip Resistor; Manufacturer: GENERIC; Manufacturer1 Part Number: NRC10F2002TRF; Power: 0.125W; TC: ±100ppm/°C; PressFit: No; Part Number: R0805_20K_1%_0.125W_100PPM; Component Kind: Standard; Component Type: Standard; Pin Count: 2; Value: 20k; Status: Preferred; Manufacturer Part Number: R0805_20K_1%_0.125W_100PPM; Case: 0805; Mounted: Yes; Sense: No; Socket: No; SMD: Yes; Manufacturer1 Example: NIC COMPONENT; Manufacturer1 ComponentHeight: 0.6mm; HelpURL: \\cern.ch\dfs\Applications\Altium\Datasheets\R0805_NIC_NRC.pdf; Author: CERN DEM JLC; CreateDate: 03.12.2007; LatestRevisionDate: 13.03.2008
R106 = R0805_33K_1%_0.125W_100PPM: Resistor - 1%; Part Description: General Purpose Thick Film Chip Resistor; Manufacturer: GENERIC; Manufacturer1 Part Number: NRC10F3302TRF; Power: 0.125W; TC: ±100ppm/°C; PressFit: No; Part Number: R0805_33K_1%_0.125W_100PPM; Component Kind: Standard; Component Type: Standard; Pin Count: 2; Value: 33k; Status: Preferred; Manufacturer Part Number: R0805_33K_1%_0.125W_100PPM; Case: 0805; Mounted: Yes; Sense: No; Socket: No; SMD: Yes; Manufacturer1 Example: NIC COMPONENT; Manufacturer1 ComponentHeight: 0.6mm; HelpURL: \\cern.ch\dfs\Applications\Altium\Datasheets\R0805_NIC_NRC.pdf; Author: CERN DEM JLC; CreateDate: 03.12.2007; LatestRevisionDate: 13.03.2008
R107 = R0805_2K_1%_0.125W_100PPM: Resistor - 1%; Part Description: General Purpose Thick Film Chip Resistor; Manufacturer: GENERIC; Manufacturer1 Part Number: NRC10F2001TRF; Power: 0.125W; TC: ±100ppm/°C; PressFit: No; Part Number: R0805_2K_1%_0.125W_100PPM; Component Kind: Standard; Component Type: Standard; Pin Count: 2; Value: 2k; Status: Preferred; Manufacturer Part Number: R0805_2K_1%_0.125W_100PPM; Case: 0805; Mounted: Yes; Sense: No; Socket: No; SMD: Yes; Manufacturer1 Example: NIC COMPONENT; Manufacturer1 ComponentHeight: 0.6mm; HelpURL: \\cern.ch\dfs\Applications\Altium\Datasheets\R0805_NIC_NRC.pdf; Author: CERN DEM JLC; CreateDate: 03.12.2007; LatestRevisionDate: 13.03.2008
R108 = R0805_9K1_1%_0.125W_100PPM: Resistor - 1%; Part Description: General Purpose Thick Film Chip Resistor; Manufacturer: GENERIC; Manufacturer1 Part Number: NRC10F9101TRF; Power: 0.125W; TC: ±100ppm/°C; PressFit: No; Part Number: R0805_9K1_1%_0.125W_100PPM; Component Kind: Standard; Component Type: Standard; Pin Count: 2; Value: 9k1; Status: Preferred; Manufacturer Part Number: R0805_9K1_1%_0.125W_100PPM; Case: 0805; Mounted: Yes; Sense: No; Socket: No; SMD: Yes; Manufacturer1 Example: NIC COMPONENT; Manufacturer1 ComponentHeight: 0.6mm; HelpURL: \\cern.ch\dfs\Applications\Altium\Datasheets\R0805_NIC_NRC.pdf; Author: CERN DEM JLC; CreateDate: 03.12.2007; LatestRevisionDate: 13.03.2008
R113 R147-R149 = R0805_330R_1%_0.125W_100PPM: as R114 on sheet PM12_LDO; Part Number: R0805_330R_1%_0.125W_100PPM; Component Kind: Standard; Component Type: Standard; Pin Count: 2; Value: 330; Status: Preferred; Manufacturer Part Number: R0805_330R_1%_0.125W_100PPM; Case: 0805; Mounted: Yes; Sense: No; Socket: No; SMD: Yes; Manufacturer1 Example: NIC COMPONENT; Manufacturer1 ComponentHeight: 0.6mm; HelpURL: \\cern.ch\dfs\Applications\Altium\Datasheets\R0805_NIC_NRC.pdf; Author: CERN DEM JLC; CreateDate: 03.12.2007; LatestRevisionDate: 13.03.2008
VD4 = LED_KINGBRIGHT_KPT-2012SURCK: LED Red 1C 2A; Part Description: 2.0X1.25mm, SMD Hyper Red Chip LED Lamp, KPT-2012 Series; PressFit: No; Bonding: No; Part Number: LED_KINGBRIGHT_KPT-2012SURCK; Component Kind: Standard; Component Type: Standard; Color: Red; PackageDescription: SMT Hyper Red LED, Case 2012, Body L 2.00mm X  W 1.25mm X H 0.75mm; Manufacturer: KINGBRIGHT; Manufacturer Part Number: KPT-2012SURCK; Pin Count: 2; Case: 0805; Mounted: Yes; Socket: No; SMD: Yes; Sense: No; ComponentHeight: 0.75mm; HelpURL: \\cern.ch\dfs\Applications\Altium\Datasheets\LED_KINGBRIGHT_KPT-2012SURCK.pdf; Author: CERN DEM BC; CreateDate: 06.11.2020; LatestRevisionDate: 06.11.2020
VD9-VD11 = LED_KINGBRIGHT_KP-2012LSGC: as VD6 on sheet PM12_LDO; Part Number: LED_KINGBRIGHT_KP-2012LSGC; Component Kind: Standard; Component Type: Standard; Color: Green; PackageDescription: 2.0x1.2mm Surface Mount Green LED; Manufacturer: KINGBRIGHT; Manufacturer Part Number: KP-2012LSGC; Pin Count: 2; Case: 0805; Mounted: Yes; Socket: No; SMD: Yes; Sense: No; ComponentHeight: 1.1mm; HelpURL: \\cern.ch\dfs\Applications\Altium\Datasheets\LED_KINGBRIGHT_KP-2012LSGC.pdf; Author: CERN DEM BC; CreateDate: 09.11.2020; LatestRevisionDate: 09.11.2020

## Sheet PM12_P3V8.SchDoc: FIT_PM12 board
size 420 x 297 mm; CheckedBy: G.Kasprowicz; Author: INR Moscow; CompanyName: WUT ISE; DrawnBy: M.Podgórski; Organization: WUT ISE; Address1: PW ISE; Address2: Nowowiejska 15/19 00-665 Warsaw; Address3: gkasprow@gmail.com; DocumentNumber: 15; Revision: 2; SheetNumber: 16; SheetTotal: 34; ModifiedBy: -; CheckedDate: -; Title2: P3V8 PSU; DivGrp: WUT ISE; Designer: INR RAS; ModifiedDate: -; ProjectName: Sensor Box
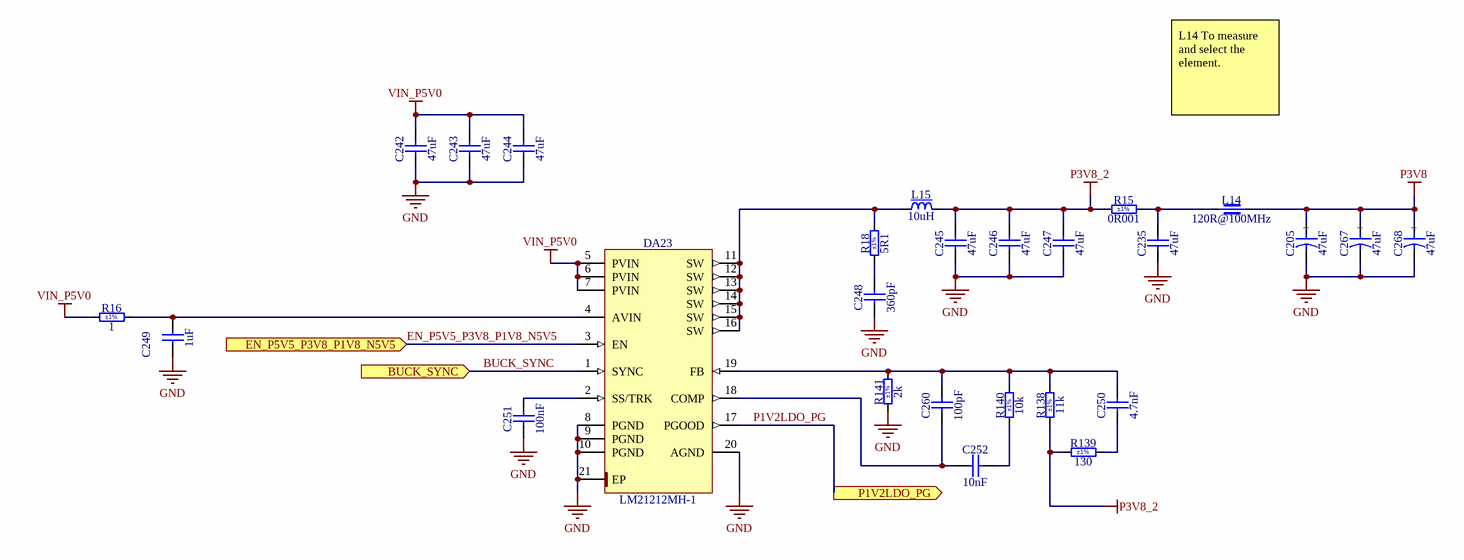
[diagram p8: PM12_P3V8.SchDoc]

### Parts
C205  47uF  [CAPAE530X610N]
C235  47uF  [CAPC3225X270N]
C242  47uF  [CAPC3225X270N]
C243  47uF  [CAPC3225X270N]
C244  47uF  [CAPC3225X270N]
C245  47uF  [CAPC3225X270N]
C246  47uF  [CAPC3225X270N]
C247  47uF  [CAPC3225X270N]
C248  360pF  [CAPC2013X145N]
C249  1uF  [CAPC2012X140N]
C250  4.7nF  [CAPC2012X135N]
C251  100nF  [CAPC2012X135N]
C252  10nF  [CAPC2012X135N]
C260  100pF  [CAPC2012X135N]
C267  47uF  [CAPAE530X610N]
C268  47uF  [CAPAE530X610N]
DA23  LM21212MH-1  [TEXAS_PWP0020AA]
L14  120R@100MHz  [IND_MURATA_BLM31KN]
L15  10uH  [IND_VISHAY_IHPL4040DZ-01]
R15  0R001  Tolerance: ±1%  [RESC_BOURNS_CRE2512_0R001-0R004]
R16  1  Tolerance: ±1%  [RESC2012X60N]
R18  5R1  Tolerance: ±1%  [RESC2012X60N]
R138  11k  Tolerance: ±1%  [RESC2012X60N]
R139  130  Tolerance: ±1%  [RESC2012X60N]
R140  10k  Tolerance: ±1%  [RESC2012X60N]
R141  2k  Tolerance: ±1%  [RESC2012X60N]

### Ports
BUCK_SYNC (in), EN_P5V5_P3V8_P1V8_N5V5 (in), P1V2LDO_PG (out)

### Nets
GND: C205.2 C235.1 C242.1 C243.1 C244.1 C245.1 C246.1 C247.1 C248.1 C249.1 C251.1 C267.2 C268.2 DA23.8(PGND) DA23.9(PGND) DA23.10(PGND) DA23.20(AGND) DA23.21(EP) R141.1
P3V8: C205.1 C267.1 C268.1 L14.2
P3V8_2: C245.2 C246.2 C247.2 L15.2 R15.1 R138.1 R139.2
VIN_P5V0: C242.2 C243.2 C244.2 DA23.5(PVIN) DA23.6(PVIN) DA23.7(PVIN) R16.1  [project net P3V3]
BUCK_SYNC: DA23.1(SYNC) ; port BUCK_SYNC
EN_P5V5_P3V8_P1V8_N5V5: DA23.3(EN) ; port EN_P5V5_P3V8_P1V8_N5V5
P1V2LDO_PG: DA23.17(PGOOD) ; port P1V2LDO_PG
NetC235_2: C235.2 L14.1 R15.2
NetC248_2: C248.2 R18.1
NetC249_2: C249.2 DA23.4(AVIN) R16.2
NetC250_1: C250.1 R139.1
NetC250_2: C250.2 C260.2 DA23.19(FB) R138.2 R140.2 R141.2
NetC251_2: C251.2 DA23.2(SS/TRK)
NetC252_1: C252.1 R140.1
NetC252_2: C252.2 C260.1 DA23.18(COMP)
NetDA23_11: DA23.11(SW) DA23.12(SW) DA23.13(SW) DA23.14(SW) DA23.15(SW) DA23.16(SW) L15.1 R18.2

### Notes on the sheet
- L14 To measure and select the element.
- Project/Equipment
- Document
- Designer
- Drawn by
- Check.by
- Copyright WUT ISE 2024.
  This documentation describes Open Hardware and is licensed under the CERN OHL v.2. You may redistribute and modify this documentation under the terms of the CERN OHL v.2. (http://ohwr.org/CERNOHL). This documentation is distributed WITHOUT ANY EXPRESS OR IMPLIED WARRANTY, INCLUDING OF MERCHANTABILITY, SATISFACTORY QUALITY AND FITNESS FOR A PARTICULAR PURPOSE. Please see the CERN OHL v.2 for applicable conditions.
- Contact
- File
- Last Mod.
- Print Date
- Sheet
- Size
- A3
- of
- Rev
- (in symbol CAE530-610_47UF_16V_20%) +

### Library data of the parts
C205 C267 C268 = CAE530-610_47UF_16V_20%: as C254 on sheet PM12_LDO; Part Number: CAE530-610_47UF_16V_20%; Component Kind: Standard; Component Type: Standard; Pin Count: 2; Value: 47uF; Status: Not Recommended; Case: C; Mounted: Yes; Socket: No; SMD: Yes; Sense: No; ComponentHeight: 6.1mm; HelpURL: \\cern.ch\dfs\Applications\Altium\Datasheets\CAE_CHIMI-CON_HXD.pdf; Author: CERN DEM HF; CreateDate: 15.04.2024; LatestRevisionDate: 15.04.2024
C235 C242-C247 = CC1210_47UF_16V_20%_X5R: Non-polarised capacitor; Part Description: SMD Multilayer Chip Ceramic Capacitor; Manufacturer: GENERIC; Manufacturer1 Part Number: EMK325BJ476MM-T; Voltage: 16V; TC: X5R; Tolerance: ±20%; Part Number: CC1210_47UF_16V_20%_X5R; Component Kind: Standard; Component Type: Standard; Pin Count: 2; Value: 47uF; Status: None; Manufacturer Part Number: CC1210_47UF_16V_20%_X5R; Case: 1210; Mounted: Yes; Socket: No; SMD: Yes; Sense: No; Manufacturer1 Example: TAIYO YUDEN; Manufacturer1 ComponentHeight: 2.7mm; HelpURL: \\cern.ch\dfs\Applications\Altium\Datasheets\CC1210_X5R_TAIYO-YUDEN_HIGH-VALUE.pdf; Author: CERN DEM MR; CreateDate: 03.02.2016; LatestRevisionDate: 03.02.2016
C248 = CC0805_360PF_50V_5%_C0G: Non-polarised capacitor; Part Description: SMD Multilayer Chip Ceramic Capacitor; Manufacturer: GENERIC; Manufacturer1 Part Number: CC0805JRNPO9BN361; Voltage: 50V; TC: NP0; Tolerance: ±5%; Part Number: CC0805_360PF_50V_5%_C0G; Component Kind: Standard; Component Type: Standard; Pin Count: 2; Value: 360pF; Status: None; Manufacturer Part Number: CC0805_360PF_50V_5%_C0G; Case: 0805; Mounted: Yes; Socket: No; SMD: Yes; Sense: No; Manufacturer1 Example: YAGEO PHYCOMP; Manufacturer1 ComponentHeight: 1.45mm; HelpURL: \\cern.ch\dfs\Applications\Altium\Datasheets\CC0805_NP0_YAGEO.pdf; Author: CERN DEM HF; CreateDate: 30.05.2024; LatestRevisionDate: 30.05.2024
C249 = CC0805_1UF_25V_10%_X7R: as C95 on sheet PM12_LDO; Part Number: CC0805_1UF_25V_10%_X7R; Component Kind: Standard; Component Type: Standard; Pin Count: 2; Value: 1uF; Status: Preferred; Manufacturer Part Number: CC0805_1UF_25V_10%_X7R; Case: 0805; Mounted: Yes; Socket: No; SMD: Yes; Sense: No; Manufacturer1 Example: KEMET; Manufacturer1 ComponentHeight: 1.4mm; HelpURL: \\cern.ch\dfs\Applications\Altium\Datasheets\CC0805_X7R_KEMET.pdf; Author: CERN DEM JLC; CreateDate: 23.03.2009; LatestRevisionDate: 23.03.2009
C250 = CC0805_4.7NF_50V_10%_X7R: Non-polarised capacitor; Part Description: SMD Multilayer Chip Ceramic Capacitor; Manufacturer: GENERIC; Manufacturer1 Part Number: 223858615632; Voltage: 50V; TC: X7R; Tolerance: ±10%; Part Number: CC0805_4.7NF_50V_10%_X7R; Component Kind: Standard; Component Type: Standard; Pin Count: 2; Value: 4.7nF; Status: Preferred; Manufacturer Part Number: CC0805_4.7NF_50V_10%_X7R; Case: 0805; Mounted: Yes; Socket: No; SMD: Yes; Sense: No; Manufacturer1 Example: PHYCOMP; Manufacturer1 ComponentHeight: 0.94mm; HelpURL: \\cern.ch\dfs\Applications\Altium\Datasheets\CC0805_X7R_PHYCOMP.pdf; Author: CERN DEM JLC; CreateDate: 03.12.2007; LatestRevisionDate: 03.12.2007
C251 = CC0805_100NF_50V_10%_X7R: Non-polarised capacitor; Part Description: SMD Multilayer Chip Ceramic Capacitor; Manufacturer: GENERIC; Manufacturer1 Part Number: C2012X7R1H104K085; Voltage: 50V; TC: X7R; Tolerance: ±10%; Part Number: CC0805_100NF_50V_10%_X7R; Component Kind: Standard; Component Type: Standard; Pin Count: 2; Value: 100nF; Status: None; Manufacturer Part Number: CC0805_100NF_50V_10%_X7R; Case: 0805; Mounted: Yes; Socket: No; SMD: Yes; Sense: No; Manufacturer1 Example: TDK; Manufacturer1 ComponentHeight: 1mm; HelpURL: \\cern.ch\dfs\Applications\Altium\Datasheets\CC0805_X7R_TDK_C.pdf; Author: CERN DEM JLC; CreateDate: 03.12.2007; LatestRevisionDate: 22.04.2015
C252 = CC0805_10NF_50V_10%_X7R: Non-polarised capacitor; Part Description: SMD Multilayer Chip Ceramic Capacitor; Manufacturer: GENERIC; Manufacturer1 Part Number: C0805C103K5RACTU; Voltage: 50V; TC: X7R; Tolerance: ±10%; Part Number: CC0805_10NF_50V_10%_X7R; Component Kind: Standard; Component Type: Standard; Pin Count: 2; Value: 10nF; Status: Preferred; Manufacturer Part Number: CC0805_10NF_50V_10%_X7R; Case: 0805; Mounted: Yes; Socket: No; SMD: Yes; Sense: No; Manufacturer1 Example: KEMET; Manufacturer1 ComponentHeight: 0.88mm; HelpURL: \\cern.ch\dfs\Applications\Altium\Datasheets\CC0805_X7R_KEMET.pdf; Author: CERN DEM JLC; CreateDate: 03.12.2007; LatestRevisionDate: 22.04.2015
C260 = CC0805_100PF_50V_5%_NP0: Non-polarised capacitor; Part Description: SMD Multilayer Chip Ceramic Capacitor; Manufacturer: GENERIC; Manufacturer1 Part Number: 223886115101; Voltage: 50V; TC: C0G/NP0; Tolerance: ±5%; Part Number: CC0805_100PF_50V_5%_NP0; Component Kind: Standard; Component Type: Standard; Pin Count: 2; Value: 100pF; Status: Preferred; Manufacturer Part Number: CC0805_100PF_50V_5%_NP0; Case: 0805; Mounted: Yes; Socket: No; SMD: Yes; Sense: No; Manufacturer1 Example: PHYCOMP; Manufacturer1 ComponentHeight: 1.35mm; HelpURL: \\cern.ch\dfs\Applications\Altium\Datasheets\CC0805_NP0_PHYCOMP.pdf; Author: CERN DEM JLC; CreateDate: 03.12.2007; LatestRevisionDate: 03.12.2007
DA23 = LM21212MH-1: 2.95-V To 5.5-V, 12-A, Voltage-Mode Synchronous Buck Regulator with Frequency Synchronization; Manufacturer: TEXAS INSTRUMENTS; PressFit: No; Bonding: No; Part Number: LM21212MH-1; Component Kind: Standard; Component Type: Standard; Device: LM21212MH-1; PackageDescription: TEXAS Case Style PWP0020AA, SOP, 0.65mm Pitch; 20 Pin, 4.40mm W X 6.50mm L X 1.10mm H body (w/thermal tab 3.4mm X 4.6mm  ), IPC Medium Density; Part Description: 2.95-V To 5.5-V, 12-A, Voltage-Mode Synchronous Buck Regulator with Frequency Synchronization; Manufacturer Part Number: LM21212MH-1; Pin Count: 21; Case: TSSOP20; Mounted: Yes; Socket: No; SMD: Yes; Sense: No; ComponentHeight: 1.1mm; HelpURL: \\cern.ch\dfs\Applications\Altium\Datasheets\LM21212MH-1.pdf; Author: CERN DEM HF; CreateDate: 05.06.2024; LatestRevisionDate: 05.06.2024
L14 = IND1206_MURATA_BLM31KN121SN1: as L7 on sheet PM12_LDO; Part Number: IND1206_MURATA_BLM31KN121SN1; Component Kind: Standard; Component Type: Standard; Footprint: IND_MURATA_BLM31KN1; Pin Count: 2; Value: 120R@100MHz; Manufacturer Part Number: BLM31KN121SN1; Case: 1206; Mounted: Yes; Socket: No; SMD: Yes; Sense: No; ComponentHeight: 1.8mm; HelpURL: \\cern.ch\dfs\Applications\Altium\Datasheets\IND1206_MURATA_ BLM31KN_SN.pdf; Author: CERN DEM HF; CreateDate: 05.01.2022; LatestRevisionDate: 05.01.2022
L15 = IND4040_10UH_20%_VISHAY_IHLP-4040DZ-01: Inductor With Core; Part Description: IHLP® Commercial Inductor, Low DCR Series; Manufacturer: VISHAY DALE; Manufacturer Part Number: IHLP4040DZER100M01; Power: 6.8A; Resistance: 0.0332R; Tolerance: ±20%; Part Number: IND4040_10UH_20%_VISHAY_IHLP-4040DZ-01; Component Kind: Standard; Component Type: Standard; Pin Count: 2; Value: 10uH; Case: 4040; Mounted: Yes; Socket: No; SMD: Yes; Sense: No; ComponentHeight: 4mm; HelpURL: \\cern.ch\dfs\Applications\Altium\Datasheets\IND_VISHAY_IHLP4040DZ-01.pdf; Author: CERN DEM HF; CreateDate: 31.05.2024; LatestRevisionDate: 31.05.2024
R15 = R2512_0R001_1%_3W_50PPM_BOURNS_CRE2512: Resistor - 1%; Part Description: High Power Current Sense Chip Resistor; Manufacturer: BOURNS; Manufacturer Part Number: CRE2512-FZ-R001E-3; Power: 3W; TC: ±50ppm/°C; PressFit: No; Part Number: R2512_0R001_1%_3W_50PPM_BOURNS_CRE2512; Component Kind: Standard; Component Type: Standard; Pin Count: 2; Value: 0R001; Status: None; Case: 2512; Mounted: Yes; Sense: No; Socket: No; SMD: Yes; ComponentHeight: 0.9mm; HelpURL: \\cern.ch\dfs\Applications\Altium\Datasheets\R2512_BOURNS_CRE2512.pdf; Author: CERN DEM BC; CreateDate: 13.10.2021; LatestRevisionDate: 13.10.2021
R16 = R0805_1R_1%_0.125W_100PPM: as R58 on sheet PM12_LDO; Part Number: R0805_1R_1%_0.125W_100PPM; Component Kind: Standard; Component Type: Standard; Pin Count: 2; Value: 1; Status: None; Manufacturer Part Number: R0805_1R_1%_0.125W_100PPM; Case: 0805; Mounted: Yes; Sense: No; Socket: No; SMD: Yes; Manufacturer1 Example: VISHAY; Manufacturer1 ComponentHeight: 0.6mm; HelpURL: \\cern.ch\dfs\Applications\Altium\Datasheets\R0805_VISHAY_CRCW e3.pdf; Author: CERN DEM HF; CreateDate: 07.06.2024; LatestRevisionDate: 07.06.2024
R18 = R0805_5R1_1%_0.125W_100PPM: Resistor - 1%; Part Description: Thick Film Chip Resistor; Manufacturer: GENERIC; Manufacturer1 Part Number: CRCW08055R10FKEAHP; Power: 0.125W; TC: ±100ppm/°C; PressFit: No; Part Number: R0805_5R1_1%_0.125W_100PPM; Component Kind: Standard; Component Type: Standard; Pin Count: 2; Value: 5R1; Status: None; Manufacturer Part Number: R0805_5R1_1%_0.125W_100PPM; Case: 0805; Mounted: Yes; Sense: No; Socket: No; SMD: Yes; Manufacturer1 Example: VISHAY; Manufacturer1 ComponentHeight: 0.6mm; HelpURL: \\cern.ch\dfs\Applications\Altium\Datasheets\R0805_VISHAY_CRCW-HP e3.pdf; Author: CERN DEM HF; CreateDate: 07.06.2024; LatestRevisionDate: 07.06.2024
R138 = R0805_11K_1%_0.125W_100PPM: Resistor - 1%; Part Description: General Purpose Thick Film Chip Resistor; Manufacturer: GENERIC; Manufacturer1 Part Number: NRC10F1102TRF; Power: 0.125W; TC: ±100ppm/°C; PressFit: No; Part Number: R0805_11K_1%_0.125W_100PPM; Component Kind: Standard; Component Type: Standard; Pin Count: 2; Value: 11k; Status: Preferred; Manufacturer Part Number: R0805_11K_1%_0.125W_100PPM; Case: 0805; Mounted: Yes; Sense: No; Socket: No; SMD: Yes; Manufacturer1 Example: NIC COMPONENT; Manufacturer1 ComponentHeight: 0.6mm; HelpURL: \\cern.ch\dfs\Applications\Altium\Datasheets\R0805_NIC_NRC.pdf; Author: CERN DEM JLC; CreateDate: 03.12.2007; LatestRevisionDate: 13.03.2008
R139 = R0805_130R_1%_0.125W_100PPM: Resistor - 1%; Part Description: General Purpose Thick Film Chip Resistor; Manufacturer: GENERIC; Manufacturer1 Part Number: NRC10F1300TRF; Power: 0.125W; TC: ±100ppm/°C; PressFit: No; Part Number: R0805_130R_1%_0.125W_100PPM; Component Kind: Standard; Component Type: Standard; Pin Count: 2; Value: 130; Status: Preferred; Manufacturer Part Number: R0805_130R_1%_0.125W_100PPM; Case: 0805; Mounted: Yes; Sense: No; Socket: No; SMD: Yes; Manufacturer1 Example: NIC COMPONENT; Manufacturer1 ComponentHeight: 0.6mm; HelpURL: \\cern.ch\dfs\Applications\Altium\Datasheets\R0805_NIC_NRC.pdf; Author: CERN DEM JLC; CreateDate: 03.12.2007; LatestRevisionDate: 13.03.2008
R140 = R0805_10K_1%_0.125W_100PPM: as R97 on sheet PM12_Supply_LED; Part Number: R0805_10K_1%_0.125W_100PPM; Component Kind: Standard; Component Type: Standard; Pin Count: 2; Value: 10k; Status: Preferred; Manufacturer Part Number: R0805_10K_1%_0.125W_100PPM; Case: 0805; Mounted: Yes; Sense: No; Socket: No; SMD: Yes; Manufacturer1 Example: NIC COMPONENT; Manufacturer1 ComponentHeight: 0.6mm; HelpURL: \\cern.ch\dfs\Applications\Altium\Datasheets\R0805_NIC_NRC.pdf; Author: CERN DEM JLC; CreateDate: 03.12.2007; LatestRevisionDate: 13.03.2008
R141 = R0805_2K_1%_0.125W_100PPM: as R107 on sheet PM12_Supply_LED; Part Number: R0805_2K_1%_0.125W_100PPM; Component Kind: Standard; Component Type: Standard; Pin Count: 2; Value: 2k; Status: Preferred; Manufacturer Part Number: R0805_2K_1%_0.125W_100PPM; Case: 0805; Mounted: Yes; Sense: No; Socket: No; SMD: Yes; Manufacturer1 Example: NIC COMPONENT; Manufacturer1 ComponentHeight: 0.6mm; HelpURL: \\cern.ch\dfs\Applications\Altium\Datasheets\R0805_NIC_NRC.pdf; Author: CERN DEM JLC; CreateDate: 03.12.2007; LatestRevisionDate: 13.03.2008